# Altium project Altium.PrjPcb
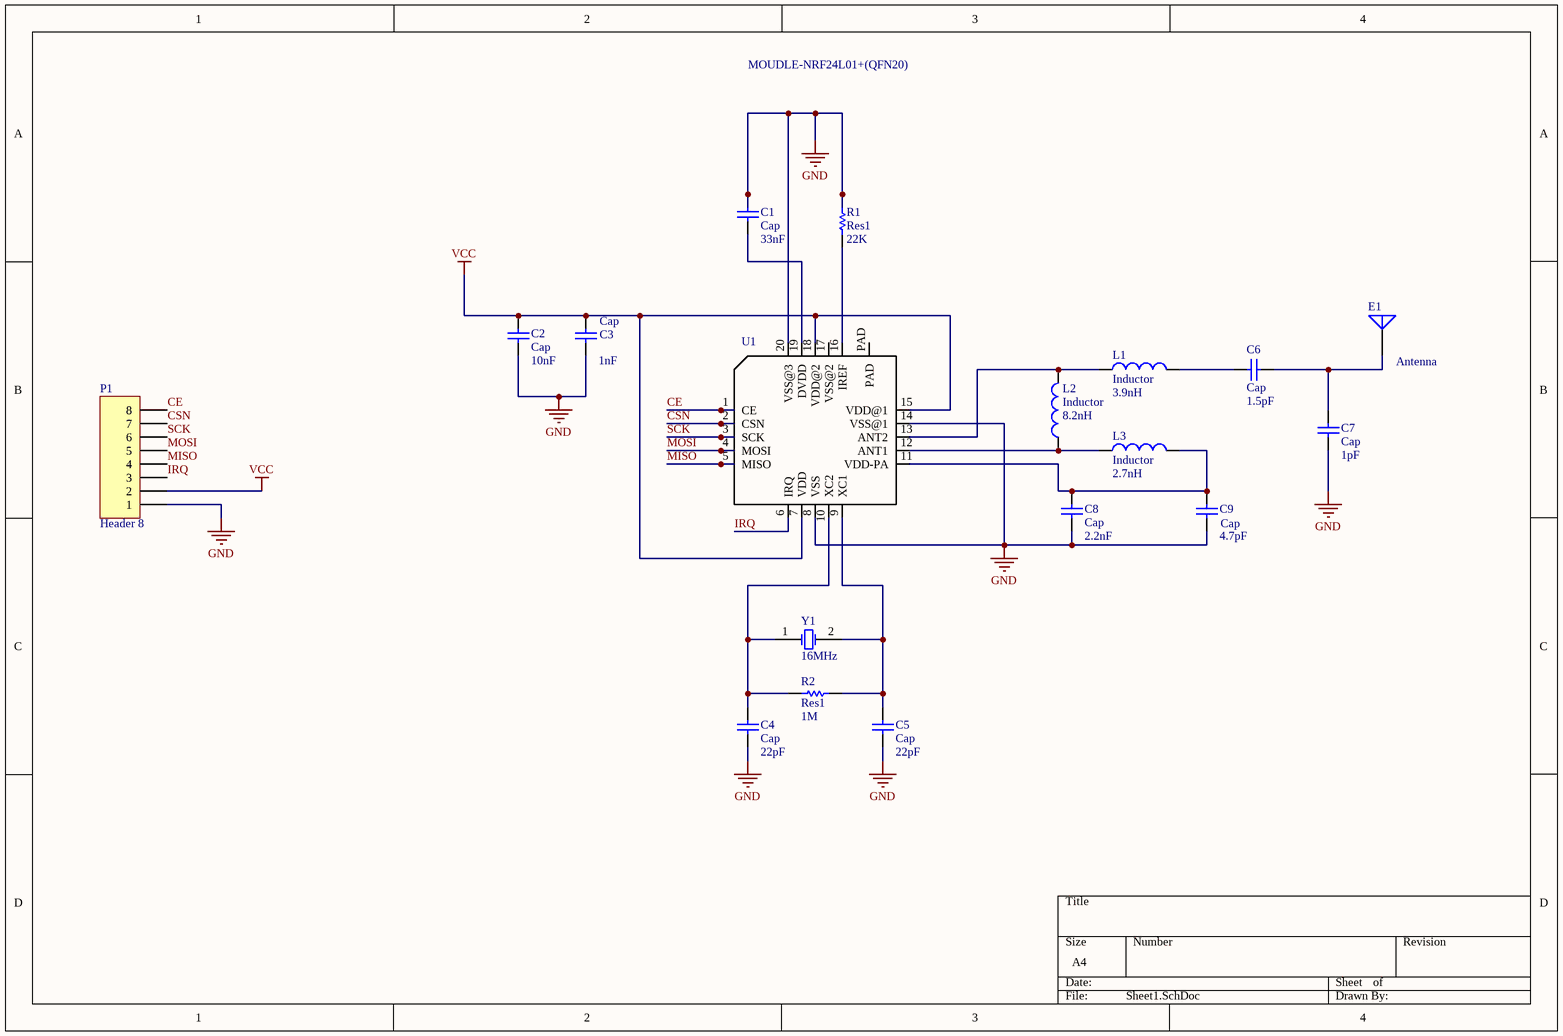
[diagram p0: Sheet1.SchDoc]
1 sheet, 18 parts. Net scope: global (net labels, ports and power ports of the same name join across sheets).
Board file: PCB1.PcbDoc

## Sheet Sheet1.SchDoc
size A4

### Parts
C1  Cap  value 33nF  [6-0805_L]
C2  Cap  value 10nF  [6-0805_L]
C3  Cap  value 1nF  [6-0805_L]
C4  Cap  value 22pF  [6-0805_L]
C5  Cap  value 22pF  [6-0805_L]
C6  Cap  value 1.5pF  [6-0805_L]
C7  Cap  value 1pF  [6-0805_L]
C8  Cap  value 2.2nF  [6-0805_L]
C9  Cap  value 4.7pF  [6-0805_L]
E1  Antenna  [ANT_SMA_RP_FEMEA_90G]
L1  Inductor  value 3.9nH  [0805IND]
L2  Inductor  value 8.2nH  [0805IND]
L3  Inductor  value 2.7nH  [0805IND]
P1  Header 8  [HDR2X4]
R1  Res1  value 22K  [6-0805_L]
R2  Res1  value 1M  [6-0805_L]
U1  MOUDLE-NRF24L01+(QFN20)  [*QFN20G-0.5-4X4MM_MOUDLE-NRF24L01+(QFN20)(Primary)]
Y1  16MHz  [R38]

### Nets
GND: C1.2 C2.1 C3.1 C4.1 C5.1 C7.1 C8.1 C9.1 P1.1 R1.2 U1.8(VSS) U1.14(VSS@1) U1.20(VSS@3)
VCC: C2.2 C3.2 P1.2 U1.7(VDD) U1.15(VDD@1) U1.18(VDD@2)
CE: P1.8 U1.1(CE)
CSN: P1.7 U1.2(CSN)
IRQ: P1.3 U1.6(IRQ)
MISO: P1.4 U1.5(MISO)
MOSI: P1.5 U1.4(MOSI)
SCK: P1.6 U1.3(SCK)
NetC1_1: C1.1 U1.19(DVDD)
NetC4_2: C4.2 R2.1 U1.10(XC2) Y1.1(OSC1)
NetC5_2: C5.2 R2.2 U1.9(XC1) Y1.2(OSC2)
NetC6_1: C6.1 L1.2
NetC6_2: C6.2 C7.2 E1.1(A)
NetC8_2: C8.2 C9.2 L3.2 U1.11(VDD-PA)
NetL1_1: L1.1 L2.2 U1.13(ANT2)
NetL2_1: L2.1 L3.1 U1.12(ANT1)
NetR1_1: R1.1 U1.16(IREF)

Not connected (* = marked no-connect by the designer): U1 17(VSS@2) PAD

### Library data of the parts
C1-C9 = Cap: Capacitor; Published: 8-Jun-2000; LatestRevisionDate: 17-Jul-2002; LatestRevisionNote: Re-released for DXP Platform.; PackageReference: RAD-0.3; Publisher: Altium Limited; PackageDescription: Radial Cap, Thru-Hole; 2 Leads; 0.3 in Pin Spacing
E1 = Antenna: Generic Antenna; Published: 24-Mar-1999; LatestRevisionDate: 17-Jul-2002; LatestRevisionNote: Re-released for DXP Platform.; PackageReference: PIN1; Publisher: Altium Limited
L1-L3 = Inductor: Code_IEC: 1005; Published: 8-Jun-2000; LatestRevisionDate: 29-May-2009; LatestRevisionNote: IPC-7351 Footprint Added.; PackageReference: 0402-A; Publisher: Altium Limited; PackageDescription: Chip Inductor; Code_JEITA: 0402
P1 = Header 8: Header, 8-Pin; LatestRevisionDate: 17-Jul-2002; LatestRevisionNote: Re-released for DXP Platform.; Publisher: Altium Limited
R1 R2 = Res1: Resistor; Published: 8-Jun-2000; LatestRevisionDate: 17-Jul-2002; LatestRevisionNote: Re-released for DXP Platform.; PackageReference: AXIAL-0.3; Publisher: Altium Limited; PackageDescription: Axial Device, Thru-Hole; 2 Leads; 0.3 in Pin Spacing
U1 = MOUDLE-NRF24L01+(QFN20): MP: NRF24L01+MODULE; MF: Seeed Technology; Package: SMD-8 Seeed Studio; SnapEDA_Link: https://www.snapeda.com/parts/NRF24L01%2BMODULE/Seeed%20Technology%20Co.%2C%20Ltd/view-part/?ref=snap; Price: None; Availability: Unavailable; Value: *
Y1 = XTAL: Crystal Oscillator; Published: 8-Jun-2000; LatestRevisionDate: 17-Jul-2002; LatestRevisionNote: Re-released for DXP Platform.; PackageReference: R38; Publisher: Altium Limited; PackageDescription: Crystal, Thru-Hole; 2 Leads; Body 3.1 x 8.2 mm (Dia.xH)